# Altium project TG21_Slave_Device_Led_1.PrjPcb
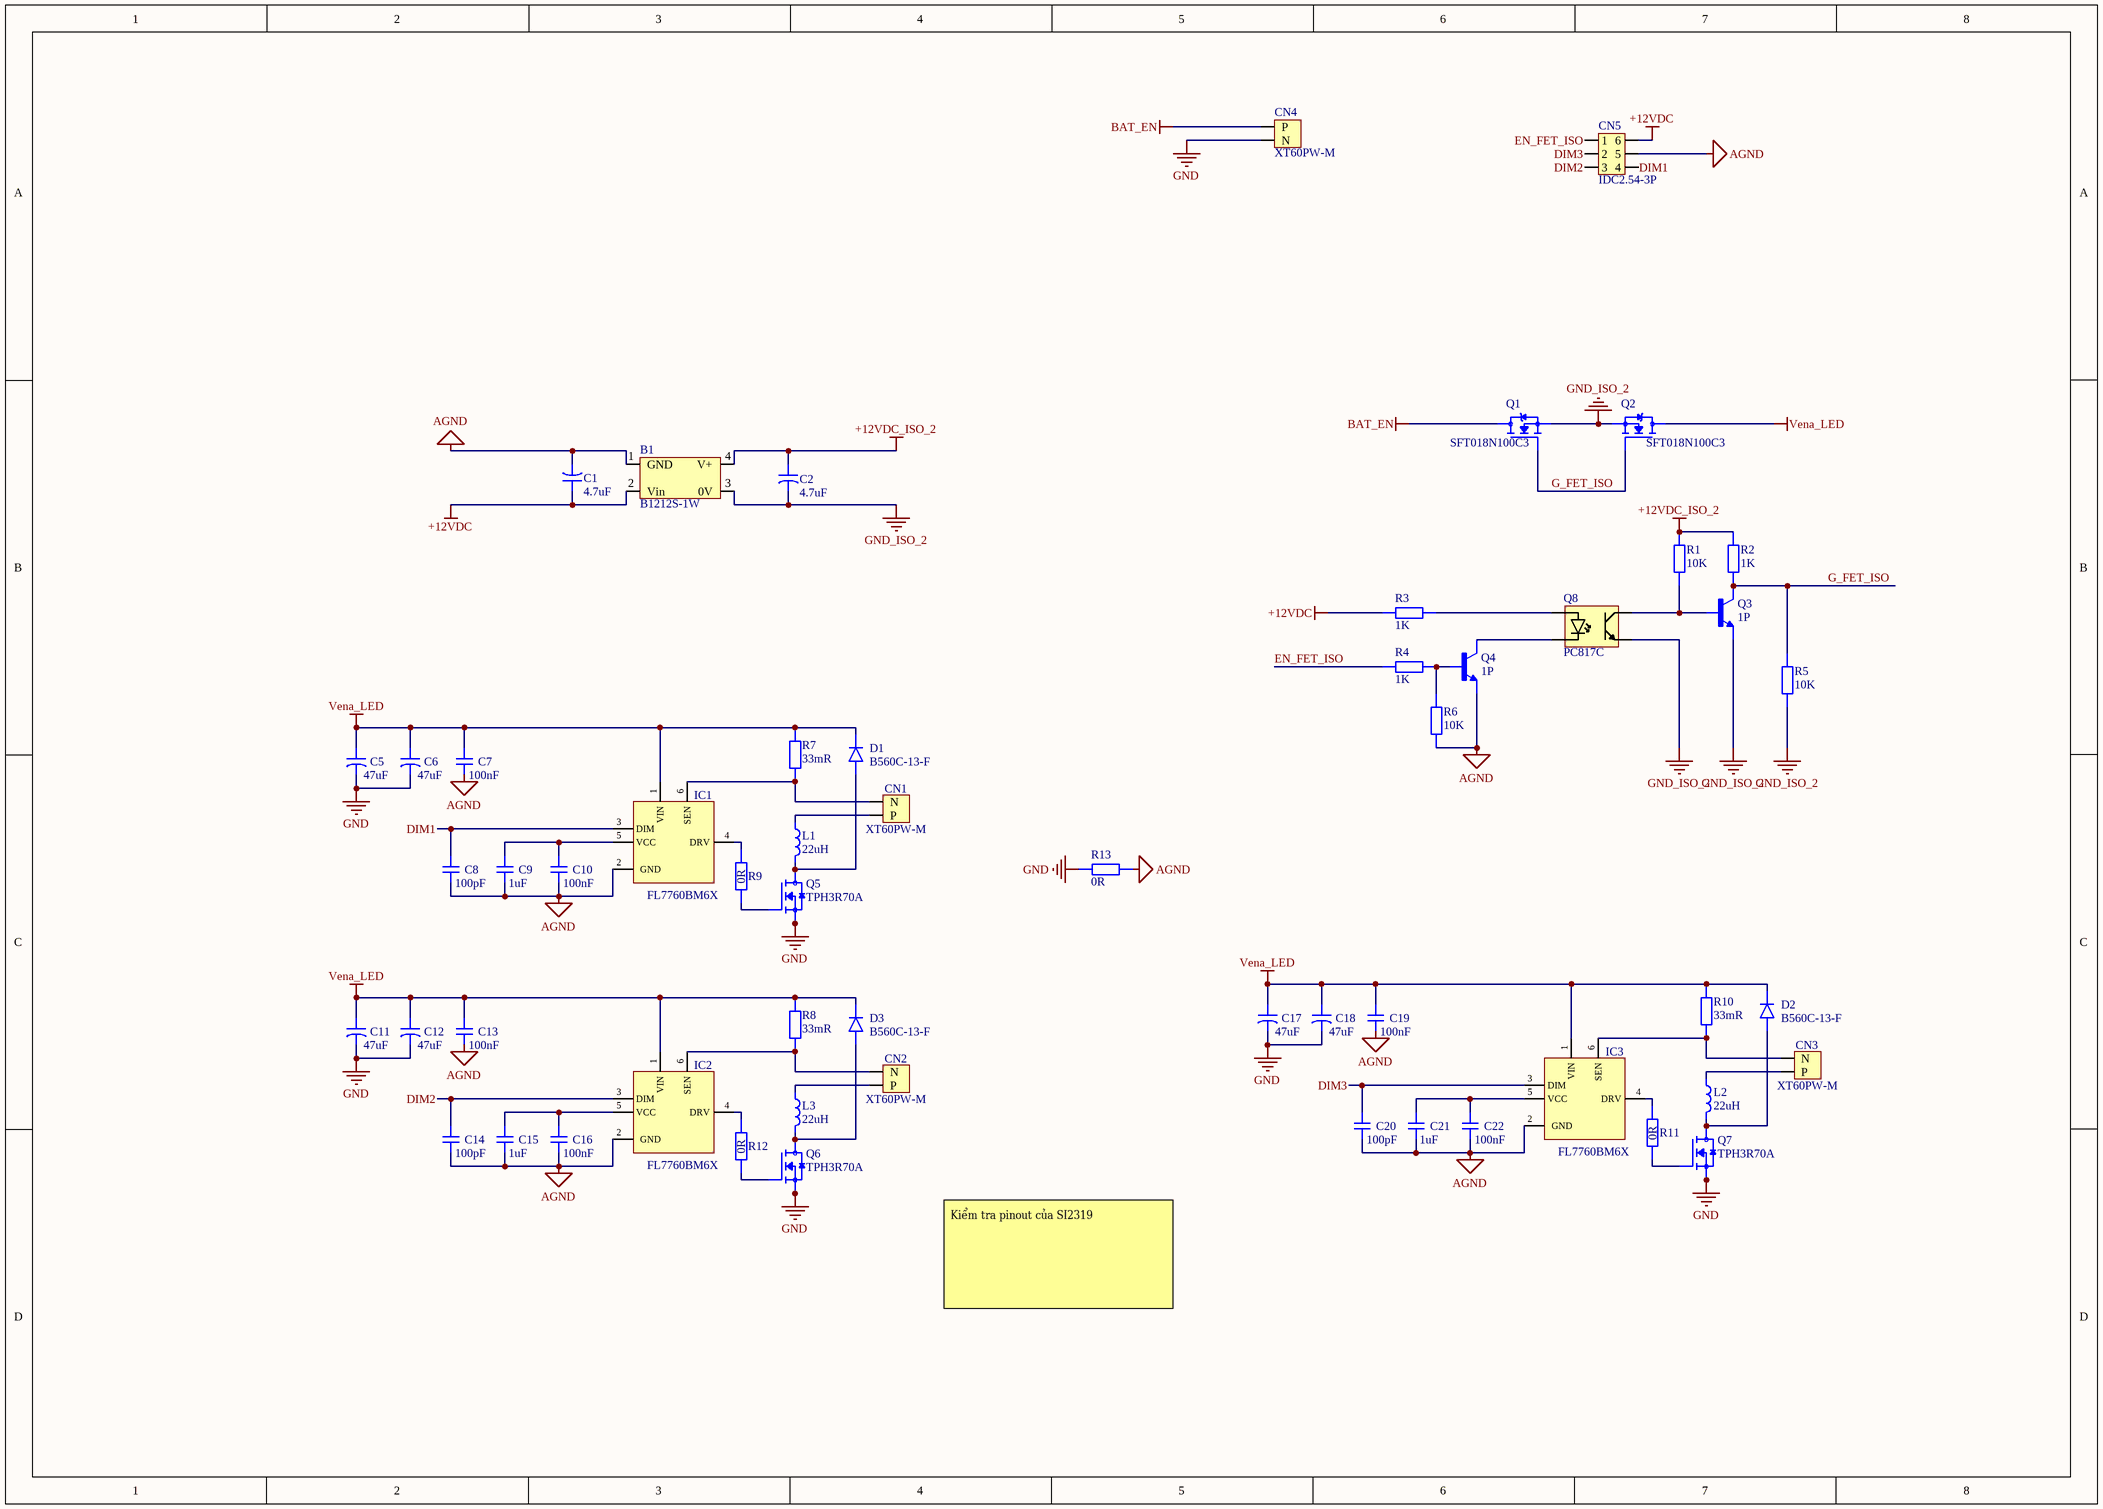
[diagram p0: TG21_Slave_Device_Led.SchDoc]
1 sheet, 56 parts. Net scope: global (net labels, ports and power ports of the same name join across sheets).
Board file: TG21_Slave_Device_Led.PcbDoc

## Sheet TG21_Slave_Device_Led.SchDoc
size A3; SheetNumber: 1; SheetTotal: 1

### Parts
B1  B1212S-1W  [SIP-4]
C1  4.7uF  [PLUGIN,D5xL11mm]
C2  4.7uF  [PLUGIN,D5xL11mm]
C5  47uF  [PLUGIN,D6.3xL12mm]
C6  47uF  [PLUGIN,D6.3xL12mm]
C7  100nF  [CAP-0603]
C8  100pF  [CAP-0603]
C9  1uF  [CAP-0603]
C10  100nF  [CAP-0603]
C11  47uF  [PLUGIN,D6.3xL12mm]
C12  47uF  [PLUGIN,D6.3xL12mm]
C13  100nF  [CAP-0603]
C14  100pF  [CAP-0603]
C15  1uF  [CAP-0603]
C16  100nF  [CAP-0603]
C17  47uF  [PLUGIN,D6.3xL12mm]
C18  47uF  [PLUGIN,D6.3xL12mm]
C19  100nF  [CAP-0603]
C20  100pF  [CAP-0603]
C21  1uF  [CAP-0603]
C22  100nF  [CAP-0603]
CN1  XT60PW-M  [XT60PW-M]
CN2  XT60PW-M  [XT60PW-M]
CN3  XT60PW-M  [XT60PW-M]
CN4  XT60PW-M  [XT60PW-M]
CN5  IDC2.54-3P  [IDC Through Hole,Right Angle,P=2.54mm, 2x3P]
D1  B560C-13-F  [SMC]
D2  B560C-13-F  [SMC]
D3  B560C-13-F  [SMC]
IC1  FL7760BM6X  [SOT23-6]
IC2  FL7760BM6X  [SOT23-6]
IC3  FL7760BM6X  [SOT23-6]
L1  22uH  [SMD,11x10mm]
L2  22uH  [SMD,11x10mm]
L3  22uH  [SMD,11x10mm]
Q1  SFT018N100C3  [TOLL]
Q2  SFT018N100C3  [TOLL]
Q3  1P  [SOT-23]
Q4  1P  [SOT-23]
Q5  TPH3R70A  [PDFN5060-8L-1.1MM]
Q6  TPH3R70A  [PDFN5060-8L-1.1MM]
Q7  TPH3R70A  [PDFN5060-8L-1.1MM]
Q8  PC817C  [SOP-4]
R1  10K  [RES-0603]
R2  1K  [RES-0603]
R3  1K  [RES-0603]
R4  1K  [RES-0603]
R5  10K  [RES-0603]
R6  10K  [RES-0603]
R7  33mR  [RES-2512]
R8  33mR  [RES-2512]
R9  0R  [RES-0603]
R10  33mR  [RES-2512]
R11  0R  [RES-0603]
R12  0R  [RES-0603]
R13  0R  [RES-0603]

### Nets
+12VDC: B1.2(Vin) C1.1 CN5.6 R3.1
+12VDC_ISO_2: B1.4(V+) C2.1 R1.2 R2.2
AGND: B1.1(GND) C1.2 C7.2 C8.2 C9.2 C10.2 C13.2 C14.2 C15.2 C16.2 C19.2 C20.2 C21.2 C22.2 CN5.5 IC1.2(GND) IC2.2(GND) IC3.2(GND) Q4.2(E) R6.1 R13.2
BAT_EN: CN4.1(P) Q1.3(D)
GND: C5.2 C6.2 C11.2 C12.2 C17.2 C18.2 CN4.2(N) Q5.1(S) Q5.2(S) Q5.3(S) Q6.1(S) Q6.2(S) Q6.3(S) Q7.1(S) Q7.2(S) Q7.3(S) R13.1
GND_ISO_2: B1.3(0V) C2.2 Q1.2(S) Q2.2(S) Q3.2(E) Q8.3(E) R5.1
Vena_LED: C5.1 C6.1 C7.1 C11.1 C12.1 C13.1 C17.1 C18.1 C19.1 D1.2(K) D2.2(K) D3.2(K) IC1.1(VIN) IC2.1(VIN) IC3.1(VIN) Q2.3(D) R7.2 R8.2 R10.2
DIM1: C8.1 CN5.4 IC1.3(DIM)
DIM2: C14.1 CN5.3 IC2.3(DIM)
DIM3: C20.1 CN5.2 IC3.3(DIM)
EN_FET_ISO: CN5.1 R4.1
G_FET_ISO: Q1.1(G) Q2.1(G) Q3.3(C) R2.1 R5.2
NetC9_1: C9.1 C10.1 IC1.5(VCC)
NetC15_1: C15.1 C16.1 IC2.5(VCC)
NetC21_1: C21.1 C22.1 IC3.5(VCC)
NetCN1_1: CN1.1(P) L1.1
NetCN1_2: CN1.2(N) IC1.6(SEN) R7.1
NetCN2_1: CN2.1(P) L3.1
NetCN2_2: CN2.2(N) IC2.6(SEN) R8.1
NetCN3_1: CN3.1(P) L2.1
NetCN3_2: CN3.2(N) IC3.6(SEN) R10.1
NetD1_1: D1.1(A) L1.2 Q5.5_8(D)
NetD2_1: D2.1(A) L2.2 Q7.5_8(D)
NetD3_1: D3.1(A) L3.2 Q6.5_8(D)
NetIC1_4: IC1.4(DRV) R9.2
NetIC2_4: IC2.4(DRV) R12.2
NetIC3_4: IC3.4(DRV) R11.2
NetQ3_1: Q3.1(B) Q8.4(C) R1.1
NetQ4_1: Q4.1(B) R4.2 R6.2
NetQ4_3: Q4.3(C) Q8.2(K)
NetQ5_4: Q5.4(G) R9.1
NetQ6_4: Q6.4(G) R12.1
NetQ7_4: Q7.4(G) R11.1
NetQ8_1: Q8.1(A) R3.2

### Notes on the sheet
- Kiểm tra pinout của SI2319

### Library data of the parts
B1 = B1212-1W: Isolated Module DC DC Converter Buck 1 Output 12V 84mA 10.8V~13.2V Input; Manufacturer: RLT; Key Attributes: DC-DC modular power supply/1000V isolation, 1W; Mfr. Part #: B1212S-1W; LCSC Part #: C512042; Package: SIP,11.6x6mm; Link: https://www.lcsc.com/product-detail/C512042.html?s_z=n_q_p_B1212-1W&spm=wm.ssy.bg.0.xh&lcsc_vid=Q1VfX1ReRFFaUFJSRgIIUV0CFFgIBFJfT1hdVlwEEVkxVlNRT1RZVlVRTlFWUTsOAxUeFF5JWBYZEEoKFBINSQcJGk4NBhADEA4cHktXRFZWSQwSGg0%3D
C1 C2 = 50YXF4R7MEFC5X11: 4.7uF 50V Aluminum Electrolytic Capacitors Through Hole,D5xL11mm 5000hrs@105℃; Manufacturer: Rubycon; Mfr.Part #: 50YXF4R7MEFC5X11; Package: Through Hole,D5xL11mm; LCSC Part #: C88759; DigiKey Part Number: 1189-1862-ND; ComponentLink1Description: Link; ComponentLink1URL: https://www.lcsc.com/product-detail/C88759.html; ComponentLink2Description: Link 1; ComponentLink2URL: https://www.digikey.com/en/products/detail/rubycon/50YXF4-7MEFC5X11/3562866?s=N4IgTCBcDaIKwAYCaANAYgFgEoHYCyAomgMJwoCM5IAugL5A
C5 C6 C11 C12 C17 C18 = ERS1JM470E12OT: 47uF 63V Aluminum Electrolytic Capacitors Through Hole,D6.3xL12mm 5000hrs@105℃; Manufacturer: AISHI; Mfr.Part #: ERS1JM470E12OT; Package: Through Hole,D6.3xL12mm; LCSC Part #: C106674; DigiKey Part Number: NO; ComponentLink1Description: Link; ComponentLink1URL: https://www.lcsc.com/product-detail/C106674.html?s_z=n_C106674; ComponentLink2Description: Link 1
C7 C10 C13 C16 C19 C22 = CL10B104KB8NNNC: 100nF ±10% 50V Ceramic Capacitor X7R 0603; Manufacturer: Samsung Electro-Mechanics; Package: 0603; LCSC Part #: C1591; Mfr.Part #: CL10B104KB8NNNC; DigiKey Part Number: 1276-1000-2-ND; ComponentLink1Description: Link; ComponentLink1URL: https://www.lcsc.com/product-detail/C1591.html?s_z=n_CL10B104KB8NNC; ComponentLink2Description: Link 1; ComponentLink2URL: https://www.digikey.com/en/products/detail/samsung-electro-mechanics/CL10B104KB8NNNC/3886658?s=N4IgTCBcDaIMIBkCMAGAQqgLAaTQDgDki4QBdAXyA
C8 C14 C20 = CL10C101JB8NNNC: 100pF ±5% 50V Ceramic Capacitor C0G 0603; Manufacturer: Samsung Electro-Mechanics; Package: 0603; Mfr.Part #: CL10C101JB8NNNC; LCSC Part #: C14858; DigiKey Part Number: 1276-1008-2-ND; ComponentLink1Description: Link; ComponentLink1URL: https://www.lcsc.com/product-detail/C14858.html?s_z=n_CL10C101JBNNNC; ComponentLink2Description: Link 1; ComponentLink2URL: https://www.digikey.com/en/products/detail/samsung-electro-mechanics/CL10C101JB8NNNC/3886666?s=N4IgTCBcDaIMIBkCMAGOqkCkBCAOAcoXCALoC%2BQA
C9 C15 C21 = CL10B105KB8NQNC: 1uF ±10% 50V Ceramic Capacitor X7R 0603; Manufacturer: Samsung Electro-Mechanics; Package: 0603; Mfr.Part #: CL10B105KB8NQNC; LCSC Part #: C5199872; DigiKey Part Number: NO; ComponentLink1Description: Link; ComponentLink1URL: https://www.lcsc.com/product-detail/C5199872.html; ComponentLink2Description: Link 1
CN1-CN4 = XT60PW-M: Banana and Tip Connector Adapters RoHS; Manufacturer: Changzhou Amass Elec; Mfr.Part #: XT60PW-M; LCSC Part #: C98732; Package: XT60PW-M; DigiKey Part Number: NO; ComponentLink1Description: Link; ComponentLink1URL: https://www.lcsc.com/product-detail/C98732.html?s_z=n_XT60
CN5 = 2.54-2*3P: Connector IDC Header Through Hole, Right Angle 6 position 2.54mm; Manufacturer: BOOMELE(Boom Precision Elec); Mfr.Part #: 2.54-2*3P; LCSC Part #: C34945; Package: Through Hole,Right Angle,P=2.54mm; DigiKey Part Number: NO; ComponentLink1Description: Link; ComponentLink1URL: https://www.lcsc.com/product-detail/C34945.html; System: Connector
D1-D3 = B560C-13-F: 100A 1 Independent 60V 700mV@5A 5A SMC(DO-214AB) Single Diodes RoHS; Manufacturer: DIODES; Mfr.Part #: B560C-13-F; Package: SMC(DO-214AB); LCSC Part #: C85100; DigiKey Part Number: NO; ComponentLink1Description: Link; ComponentLink1URL: https://www.lcsc.com/product-detail/C85100.html?s_z=n_C85100; ComponentLink2Description: Link 1; ComponentLink2URL: https://www.digikey.com/en/products/detail/diodes-incorporated/B560C-13-F/768773
IC1-IC3 = FL7760BM6X: High-Side Sensing Constant Current Buck Controller for High Switching Frequency LED Driver; Manufacturer: onsemi; Mfr.Part #: FL7760BM6X; Package: SOT-23-6; LCSC Part #: C367388; DigiKey Part Number: FL7760BM6XOSTR-ND; ComponentLink1Description: Link; ComponentLink1URL: https://www.lcsc.com/product-detail/C367388.html?s_z=n_FL7760&spm=wm.ssy.bg.0.xh&lcsc_vid=QVhYA1deElkMBVEAQVVWVAECEVVXUAcCTgNYUQVSEVAxVlNRQ1hYVFBfTlhcXzsOAxUeFF5JWBYZEEoKFBINSQcJGk4eFQsCAgIaSgADAwAHC0slRlleUFNRQlhADxALGw%3D%3D; ComponentLink2Description: Link 1; ComponentLink2URL: https://www.digikey.com/en/products/detail/onsemi/FL7760BM6X/7804375?s=N4IgTCBcDaIGIBkDsSBsAGAQgWVQDRAF0BfIA
L1-L3 = PSPMAA1082T-220M-CGP: 8A 22uH 35mΩ 10A Molded Inductor ±20% SMD,11x10mm Fixed Inductors RoHS; Manufacturer: PROD Tech; Mfr.Part #: PSPMAA1082T-220M-CGP; Package: SMD,11x10mm; LCSC Part #: C47149121; DigiKey Part Number: NO; ComponentLink1Description: Link; ComponentLink1URL: https://www.lcsc.com/product-detail/C47149121.html?s_z=n_C47149121; ComponentLink2Description: Link 1
Q1 Q2 = SFT018N100C3: N-Channel 100V 320A 312W Surface Mount TOLL; Manufacturer: SCILICON; Package: TOLL; Mfr.Part #: SFT018N100C3; LCSC Part #: C42395330; DigiKey Part Number: NO; ComponentLink1Description: Link; ComponentLink1URL: https://www.lcsc.com/product-detail/C42395330.html?s_z=n_c42395330; ComponentLink2Description: Link 1
Q3 Q4 = MMBT2222ALT1G: Bipolar (BJT) Transistor NPN 40V 600mA 225mW Surface Mount SOT-23; Manufacturer: onsemi; Mfr.Part #: MMBT2222ALT1G; LCSC Part #: C82460; Package: SOT-23; DigiKey Part Number: MMBT2222ALT1GOSTR-ND; ComponentLink1Description: Link; ComponentLink1URL: https://www.lcsc.com/product-detail/C82460.html?s_z=n_mmbt; ComponentLink2Description: Link 1; ComponentLink2URL: https://www.digikey.com/en/products/detail/onsemi/MMBT2222ALT1G/919593
Q5-Q7 = TPH3R70APL,L1Q(M: N-Channel 100V 90A 170W SOP-8-Advance; Manufacturer: TOSHIBA; Package: PDFN5060-8L; Mfr.Part #: TPH3R70APL,L1Q(M; LCSC Part #: C471285; DigiKey Part Number: 264-TPH3R70APLL1QTR-ND; ComponentLink1Description: Link; ComponentLink1URL: https://www.lcsc.com/product-detail/C20605803.html?s_z=n_YJG60N04AQ; ComponentLink2Description: Link 1; ComponentLink2URL: 264-TPH3R70APLL1QTR-ND
Q8 = HXY MOSFET PC817C: Phototransistor Output 5kVrms 1 Channel SMD-4P; Manufacturer: HXY MOSFET; Mfr.Part #: PC817C; LCSC Part #: C5451663; Package: SMD-4P; DigiKey Part Number: NO; ComponentLink1Description: Link; ComponentLink1URL: https://www.lcsc.com/product-detail/C5451663.html?s_z=n_c5451663; ComponentLink2Description: Link 1
R1 R5 R6 = RC0603FR-0710KL: 100mW 10kΩ 75V Thick Film Resistor ±100ppm/℃ ±1% 0603 Chip Resistor - Surface Mount RoHS; Manufacturer: YAGEO; Package: 0603; LCSC Part #: C98220; Mfr.Part #: RC0603FR-0710KL; DigiKey Part Number: 311-10.0KHRTR-ND; ComponentLink1Description: Link; ComponentLink1URL: https://www.lcsc.com/product-detail/C98220.html?s_z=n_C98220; ComponentLink2Description: Link 1; ComponentLink2URL: https://www.digikey.com/en/products/detail/yageo/RC0603FR-0710KL/726880?s=N4IgTCBcDaIMwEYEFoEAYB0aDSAJASgCr7IByAIiALoC%2BQA
R2-R4 = RC0603FR-071KL: 100mW 1kΩ 75V Thick Film Resistor ±100ppm/℃ ±1% 0603 Chip Resistor - Surface Mount RoHS; Manufacturer: YAGEO; Mfr.Part #: RC0603FR-071KL; Package: 0603; LCSC Part #: C22548; DigiKey Part Number: 311-1.00KHRTR-ND; ComponentLink1Description: Link; ComponentLink1URL: https://www.lcsc.com/product-detail/C22548.html?s_z=n_C22548; ComponentLink2Description: Link 1; ComponentLink2URL: https://www.digikey.com/en/products/detail/yageo/RC0603FR-071KL/726843?s=N4IgTCBcDaIEoGEAMA2JBmAYnAtEg7AIwDSAMiALoC%2BQA
R7 R8 R10 = HoLLR2512-3W-33mR-1%: 33mΩ 3W Current Sense Resistor ±1% ±50ppm/℃ 2512 Chip Resistor - Surface Mount RoHS; Manufacturer: Milliohm; Mfr.Part #: HoLLR2512-3W-33mR-1%; Package: 2512; LCSC Part #: C2985721; DigiKey Part Number: NO; ComponentLink1Description: Link; ComponentLink1URL: https://www.lcsc.com/product-detail/C2985721.html?spm=wm.fly.bg.0.xh&lcsc_vid=EQVeAlBQE1lfUQdeRVANVgZXElUKUAUCRwdWVVRWQVUxVlNRQ1hbUlRURFJdVDtW; ComponentLink2Description: Link 1
R9 R11-R13 = RC0603FR-070RL: 0Ω 100mW 75V Thick Film Resistor ±1% 0603 Chip Resistor - Surface Mount RoHS; Manufacturer: YAGEO; Mfr.Part #: RC0603FR-070RL; Package: 0603; LCSC Part #: C100044; DigiKey Part Number: 311-0.0HRTR-ND; ComponentLink1Description: Link; ComponentLink1URL: https://www.lcsc.com/product-detail/C100044.html?s_z=n_0R; ComponentLink2Description: Link 1; ComponentLink2URL: https://www.digikey.com/en/products/detail/yageo/RC0603FR-070RL/1304008?s=N4IgTCBcDaIEoGEAMA2JBmAYnAtEg7EnADIgC6AvkA